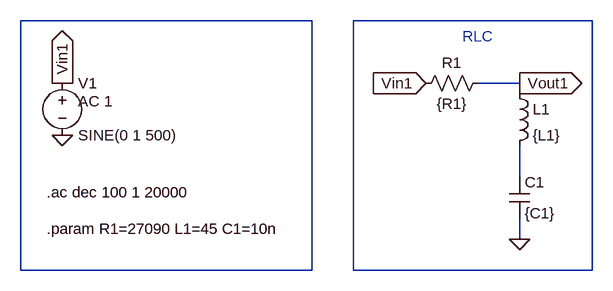
[diagram p0: schematic RLC.asc]
RLC.asc, the LTspice schematic file:
Version 4
SHEET 1 1100 680
WIRE 96 96 -352 96
WIRE 528 96 160 96
WIRE 416 192 352 192
WIRE 416 208 416 192
WIRE 416 336 416 288
WIRE 416 432 416 400
WIRE -352 480 -352 96
WIRE 96 480 96 96
WIRE 96 480 -352 480
WIRE 160 480 160 96
WIRE 528 480 528 96
WIRE 528 480 160 480
FLAG 416 432 0
FLAG 272 192 Vin1
IOPIN 272 192 In
FLAG 416 192 Vout1
IOPIN 416 192 Out
FLAG -288 272 0
FLAG -288 192 Vin1
IOPIN -288 192 Out
SYMBOL res 368 176 R90
WINDOW 0 0 56 VBottom 2
WINDOW 3 32 56 VTop 2
SYMATTR InstName R1
SYMATTR Value {R1}
SYMBOL ind 400 192 R0
SYMATTR InstName L1
SYMATTR Value {L1}
SYMBOL cap 400 336 R0
SYMATTR InstName C1
SYMATTR Value {C1}
SYMBOL voltage -288 176 R0
WINDOW 123 24 44 Left 2
WINDOW 39 0 0 Left 0
SYMATTR Value2 AC 1
SYMATTR InstName V1
SYMATTR Value SINE(0 1 500)
TEXT -312 416 Left 2 !.param R1=27090 L1=45 C1=10n
TEXT -312 360 Left 2 !.ac dec 100 1 20000
TEXT 328 120 Left 2 ;RLC

The netlist it stands for:
* RLC.asc
R1 Vout1 Vin1 {R1}
L1 Vout1 N003 {L1}
C1 N003 0 {C1}
V1 Vin1 0 SINE(0 1 500) AC 1
.param R1=27090 L1=45 C1=10n
.ac dec 100 1 20000
* RLC
.backanno
.end